# EasyEDA Pro project ax08_doc.eprj, board frontpanel
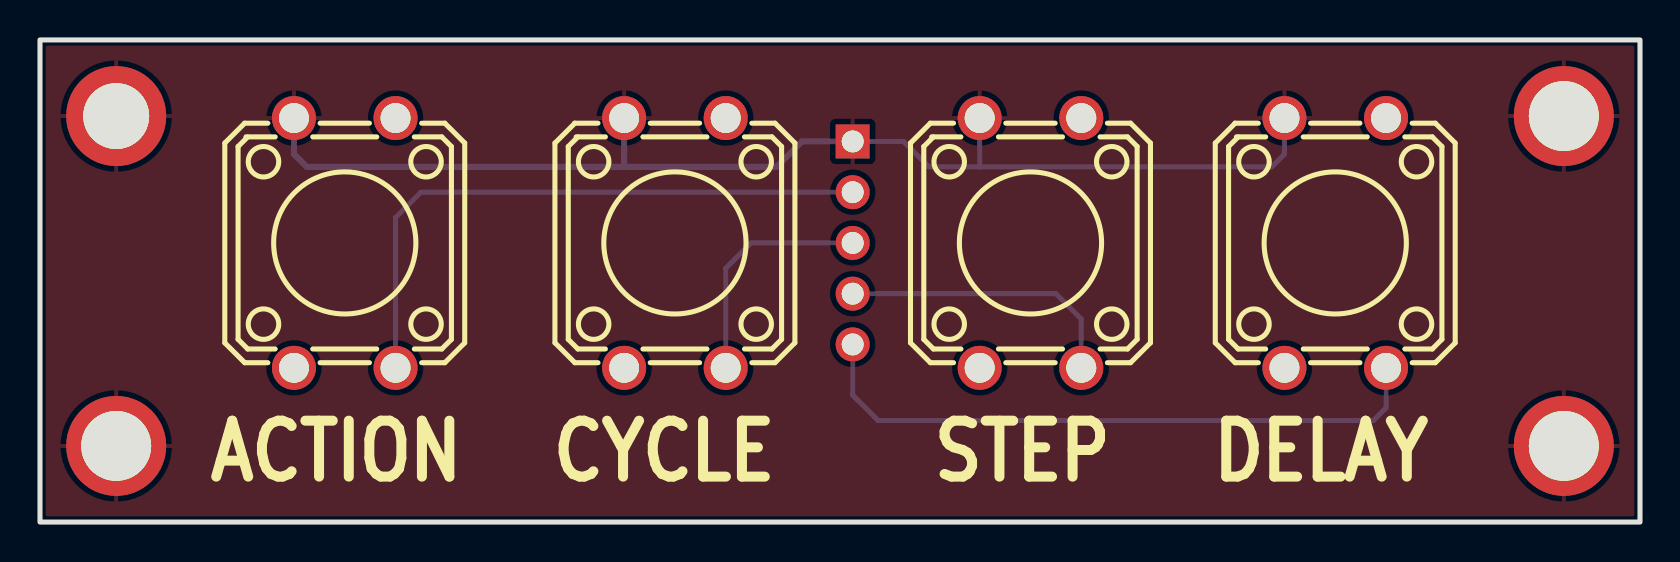
[diagram p30: board, top side]
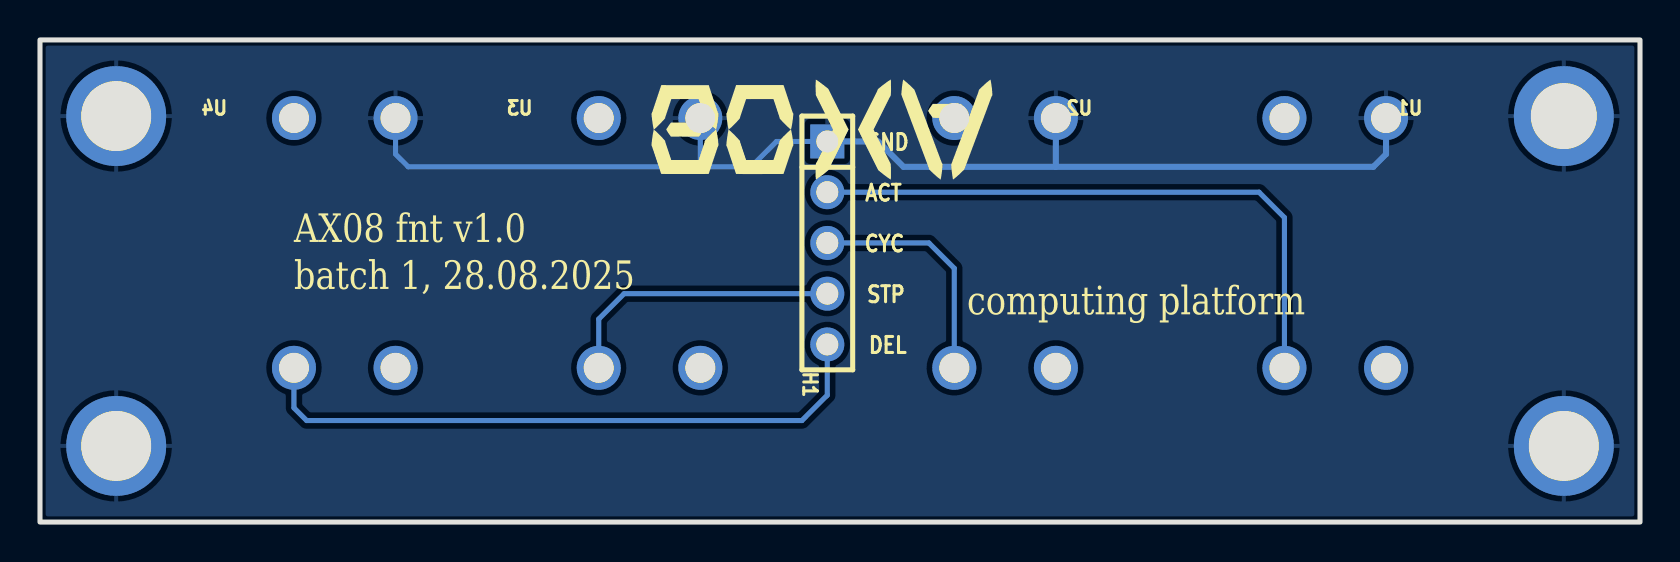
[diagram p31: board, bottom side, seen from below]

Outline 80.01 x 24.13 mm; copper layers: Top Layer, Bottom Layer. Coordinates in mm from the lower left corner of the outline.
Outline path: rectangle 0,24.13 80.01,0
Stack: Top Layer 0.035mm / Dielectric1 1.51mm FR4 er 4.5 / Bottom Layer 0.035mm

## Design rules (mm)
template: JLCPCB Capability(Two Layers Board)
spacing copperThickness1oz (default): track to track 0.102, other pairs 0.152 to 0.3
spacing copperThickness2oz: track to track 0.203, other pairs 0.152 to 0.3
track width copperThickness1oz (default): min 0.127, default 0.254, max 2.54
track width copperThickness2oz: min 0.203, default 0.254, max 2.54
differential pair differentialPair (default): width min 0.127, default 0.254, max 2.54; gap min 0.152, default 0.152
via viaSize (default): diameter min 0.5, default 0.61, max 10; hole min 0.3, default 0.305, max 6.3

## Placement (name value [footprint] x y rotation side)
H1  PZ254V-11-05P  [HDR-TH_5P-P2.54-V-M]  40.64 13.97 270 bottom
NOREF  -  [Pad_e7]  3.81 3.81 0 top
NOREF#2  -  [Pad_e26]  76.2 3.81 0 top
NOREF#3  -  [Pad_e25]  76.2 20.32 0 top
NOREF#4  -  [Pad_e9]  3.81 20.32 0 top
U1  ZX-QC1212-7.5CJ  [KEY-TH_4P-L12.0-W12.0-P5.00-LS12.5]  15.24 13.97 270 top
U2  ZX-QC1212-7.5CJ  [KEY-TH_4P-L12.0-W12.0-P5.00-LS12.5]  31.75 13.97 270 top
U3  ZX-QC1212-7.5CJ  [KEY-TH_4P-L12.0-W12.0-P5.00-LS12.5]  49.53 13.97 270 top
U4  ZX-QC1212-7.5CJ  [KEY-TH_4P-L12.0-W12.0-P5.00-LS12.5]  64.77 13.97 270 top

## Footprints (pads in the part's own frame, mm; a bottom-side part is the same pattern mirrored in y, then rotated)
HDR-TH_5P-P2.54-V-M
  rect 1.7x1.7 hole 1.1: 1(-5.08,0)
  round 1.7 hole 1.1: 2(-2.54,0) 3(0,0) 4(2.54,0) 5(5.08,0)
KEY-TH_4P-L12.0-W12.0-P5.00-LS12.5
  round 2.2 hole 1.5: 1(-6.251,2.54) 2(6.251,2.54) 3(-6.251,-2.54) 4(6.251,-2.54)
Pad_e7
  round 5 hole 3.5x3.3: 1(0,0)
Pad_e9
  round 5 hole 3.3: 1(0,0)
Pad_e25
  round 5 hole 3.5x3.3: 1(0,0)
Pad_e26
  round 5 hole 3.5x3.3: 1(0,0)

## Nets
As in the schematic, except:
GND: H1.1 NOREF.1 NOREF#2.1 NOREF#3.1 NOREF#4.1 U1.3 U2.3 U3.3 U4.3

Pads without a net: U1 1 4; U2 1 4; U3 1 4; U4 1 4

## Routing (per net, layer and track width the routed paths; a pad name or vN(x,y) marks a point on that pad's centre or on a via; arc(x,y) is an arc through that point)
GND: length 59.6
  Bottom Layer w0.254: 46.99,17.78 44.45,17.78 43.18,19.05 H1.1 ; 46.99,17.78 61.59,17.78 62.23,18.41 U4.3 ; 46.99,17.78 U3.3
  Bottom Layer w0.305: H1.1 38.1,19.05 36.83,17.78 29.21,17.78 ; U1.3 12.7,18.41 13.33,17.78 29.21,17.78 ; 29.21,17.78 U2.3
ACTION: length 30.9
  Bottom Layer w0.254: U1.2 17.78,15.24 19.05,16.51 H1.2
CYCLE: length 11.9
  Bottom Layer w0.254: U2.2 34.29,12.7 35.56,13.97 H1.3
DELAY: length 32
  Bottom Layer w0.254: H1.5 40.64,6.35 41.91,5.08 66.68,5.08 67.31,5.71 U4.2
STEP: length 14.4
  Bottom Layer w0.254: U3.2 52.07,10.16 50.8,11.43 H1.4

## Copper pours and planes (outline as drawn; the poured copper is in the pictures)
GND on Top Layer: 0,24.13 80.01,24.13 80.01,0 0,0
GND on Bottom Layer: 0,24.13 80.01,24.13 80.01,0 0,0

## Text on the board
Bottom Silkscreen Layer: GND | DEL | STP | ACT | CYC | AX08 fnt v1.0 / batch 1, 28.08.2025 | computing platform
Top Silkscreen Layer: ACTION | CYCLE | STEP | DELAY
